# EAGLE design Oled Lochraster (EAGLE 5.10)
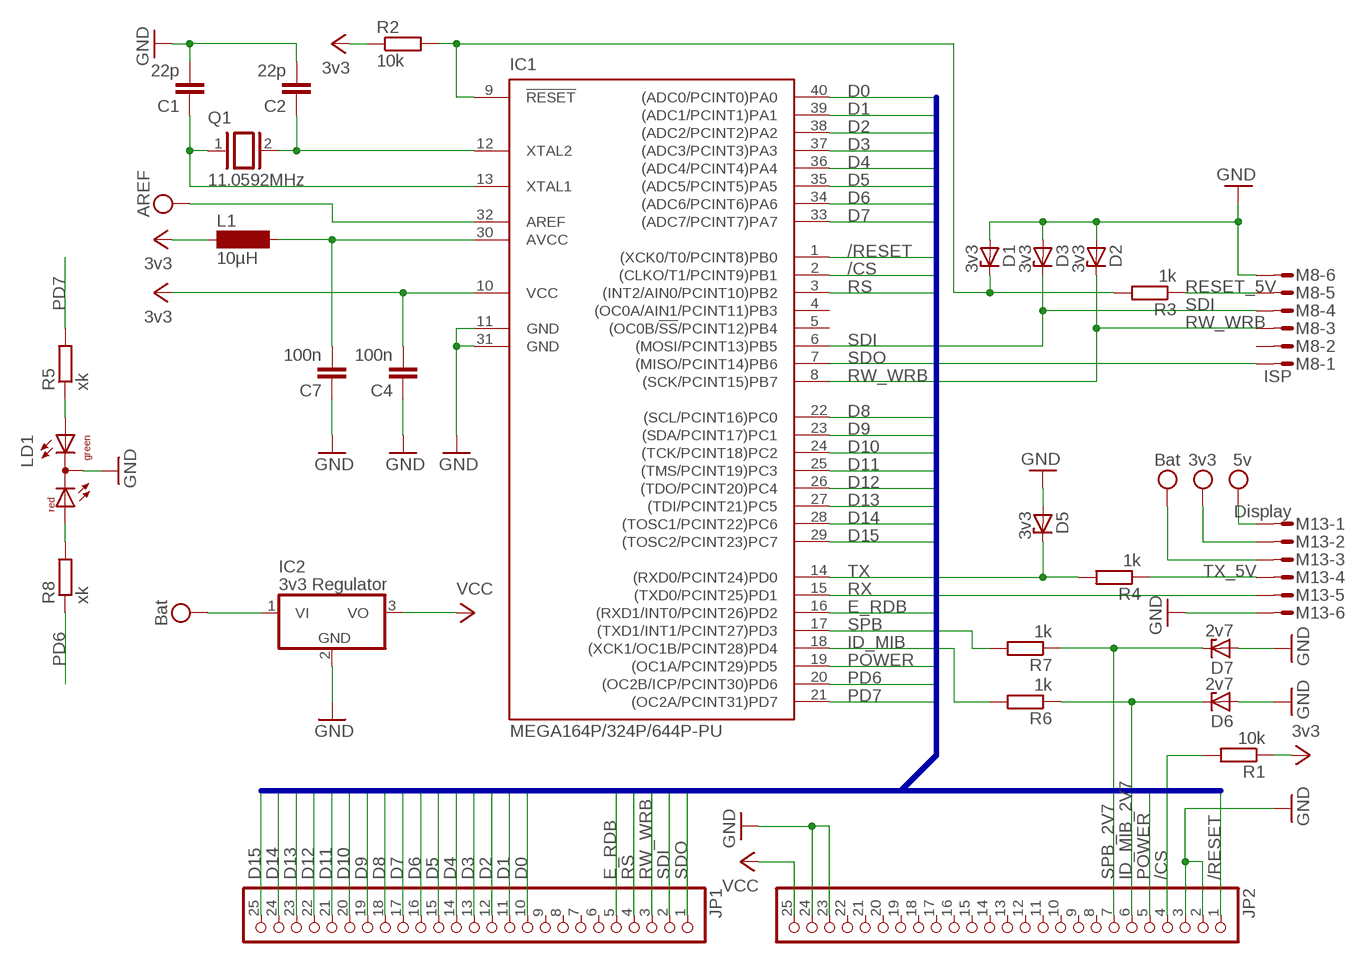
[diagram p0: schematic, sheet 1]

## Parts
C1  22p  C-EUC0805  [C0805]
C2  22p  C-EUC0805  [C0805]
C4  100n  C-EUC0805  [C0805]
C7  100n  C-EUC0805  [C0805]
D1  3v3  ZTE  [DO35Z10]
D2  3v3  ZTE  [DO35Z10]
D3  3v3  ZTE  [DO35Z10]
D5  3v3  ZTE  [DO35Z10]
D6  2v7  ZTE  [DO35Z10]
D7  2v7  ZTE  [DO35Z10]
IC1  MEGA164P/324P/644P-PU  [DIL40]
IC2  3v3 Regulator  7805T  [TO220H]
JP1  PINHD-1X25  [1X25]
JP2  PINHD-1X25  [1X25]
L1  10µH  SM-1206  [SM-1206]
LD1  DUOLED-RG-C  [DUOLED-C-5MM]
M8  ISP  MICROMATCH-6  [MICROMATCH-6]
M13  Display  MICROMATCH-6  [MICROMATCH-6]
Q1  11.0592MHz  XTAL/S  [QS]
R1  10k  R-EU_R0805  [R0805]
R2  10k  R-EU_R0805  [R0805]
R3  1k  R-EU_R0805  [R0805]
R4  1k  R-EU_R0805  [R0805]
R5  xk  R-EU_R0805  [R0805]
R6  1k  R-EU_R0805  [R0805]
R7  1k  R-EU_R0805  [R0805]
R8  xk  R-EU_R0805  [R0805]

## Nets
3V3: C4.2 IC1.10(VCC) L1.1 M13.2 R1.1 R2.1 ; supply symbol labelled 3v3
5V: M13.1 ; supply symbol labelled 5v
/CS: IC1.2((CLKO/T1/PCINT9)PB1) JP2.4 R1.2
/RESET: IC1.1((XCK0/T0/PCINT8)PB0) JP2.1
AREF: IC1.32(AREF)
AVCC: C7.2 IC1.30(AVCC) L1.2
BAT: IC2.1(VI) M13.3 ; supply symbol labelled Bat
D0: IC1.40((ADC0/PCINT0)PA0) JP1.10
D1: IC1.39((ADC1/PCINT1)PA1) JP1.11
D2: IC1.38((ADC2/PCINT2)PA2) JP1.12
D3: IC1.37((ADC3/PCINT3)PA3) JP1.13
D4: IC1.36((ADC4/PCINT4)PA4) JP1.14
D5: IC1.35((ADC5/PCINT5)PA5) JP1.15
D6: IC1.34((ADC6/PCINT6)PA6) JP1.16
D7: IC1.33((ADC7/PCINT7)PA7) JP1.17
D8: IC1.22((SCL/PCINT16)PC0) JP1.18
D9: IC1.23((SDA/PCINT17)PC1) JP1.19
D10: IC1.24((TCK/PCINT18)PC2) JP1.20
D11: IC1.25((TMS/PCINT19)PC3) JP1.21
D12: IC1.26((TDO/PCINT20)PC4) JP1.22
D13: IC1.27((TDI/PCINT21)PC5) JP1.23
D14: IC1.28((TOSC1/PCINT22)PC6) JP1.24
D15: IC1.29((TOSC2/PCINT23)PC7) JP1.25
E_RDB: IC1.16((RXD1/INT0/PCINT26)PD2) JP1.5
GND: C1.2 C2.2 C4.1 C7.1 D1.A D2.A D3.A D5.A D6.A D7.A IC1.11(GND) IC1.31(GND) IC2.2(GND) JP2.2 JP2.3 JP2.23 JP2.24 LD1.C M8.6 M13.6
ID_MIB: IC1.18((XCK1/OC1B/PCINT28)PD4) R6.2
ID_MIB_2V7: D6.C JP2.6 R6.1
N$1: LD1.AR R8.2
N$2: LD1.AX(AG) R5.1
PD6: IC1.20((OC2B/ICP/PCINT30)PD6) R8.1
PD7: IC1.21((OC2A/PCINT31)PD7) R5.2
POWER: IC1.19((OC1A/PCINT29)PD5) JP2.5
RESET: D1.C R2.2 R3.2
RESET_5V: M8.5 R3.1
RS: IC1.3((INT2/AIN0/PCINT10)PB2) JP1.4
RW_WRB: D2.C IC1.8((SCK/PCINT15)PB7) JP1.3 M8.3
RX: IC1.15((TXD0/PCINT25)PD1) M13.5
SDI: D3.C IC1.6((MOSI/PCINT13)PB5) JP1.2 M8.4
SDO: IC1.7((MISO/PCINT14)PB6) JP1.1 M8.1
SPB: IC1.17((TXD1/INT1/PCINT27)PD3) R7.2
SPB_2V7: D7.C JP2.7 R7.1
TX: D5.C IC1.14((RXD0/PCINT24)PD0) R4.2
TX_5V: M13.4 R4.1
VCC: IC2.3(VO) JP2.25
XTAL1: C1.1 IC1.13(XTAL1) Q1.1
XTAL2: C2.1 IC1.12(XTAL2) Q1.2
Unconnected: IC1.4((OC0A/AIN1/PCINT11)PB3) IC1.5((OC0B/!SS!/PCINT12)PB4) IC1.9(!RESET) JP1.6 JP1.7 JP1.8 JP1.9 JP2.8 JP2.9 JP2.10 JP2.11 JP2.12 JP2.13 JP2.14 JP2.15 JP2.16 JP2.17 JP2.18 JP2.19 JP2.20 JP2.21 JP2.22 M8.2

## Buses
B$1

## Library data of the parts
C1 C2 C4 C7 = rcl:C-EU: CAPACITOR, European symbol
D1-D3 D5-D7 = diode:ZTE: Z DIODE 300 mW
IC1 = avr-6:MEGA164P/324P/644P-PU
IC2 = pst-dimension-engineering:78*: Positive VOLTAGE REGULATOR Source: http://cache.national.com/ds/LM/LM78L05.pdf http://www.fairchildsemi.com/ds/LM/LM7805.pdf
JP1 JP2 = pinhead:PINHD-1X25: PIN HEADER
L1 = inductor-neosid:SM-1206: INDUCTOR SMD chip inductor
LD1 = led:DUOLED-RG-C: DUO LED 2 colors (red/green), 5 mm, round, common Cathode www.ligitek.com or other producers.
M8 M13 = con-amp-micromatch:MICROMATCH-6: MicroMaTch 6 7-215464-6 / 0-215464-6 Drawing Number C-215464 DDEController.pdf
Q1 = special:XTAL/S: CRYSTAL
R1-R8 = rcl:R-EU_: RESISTOR, European symbol

## Board
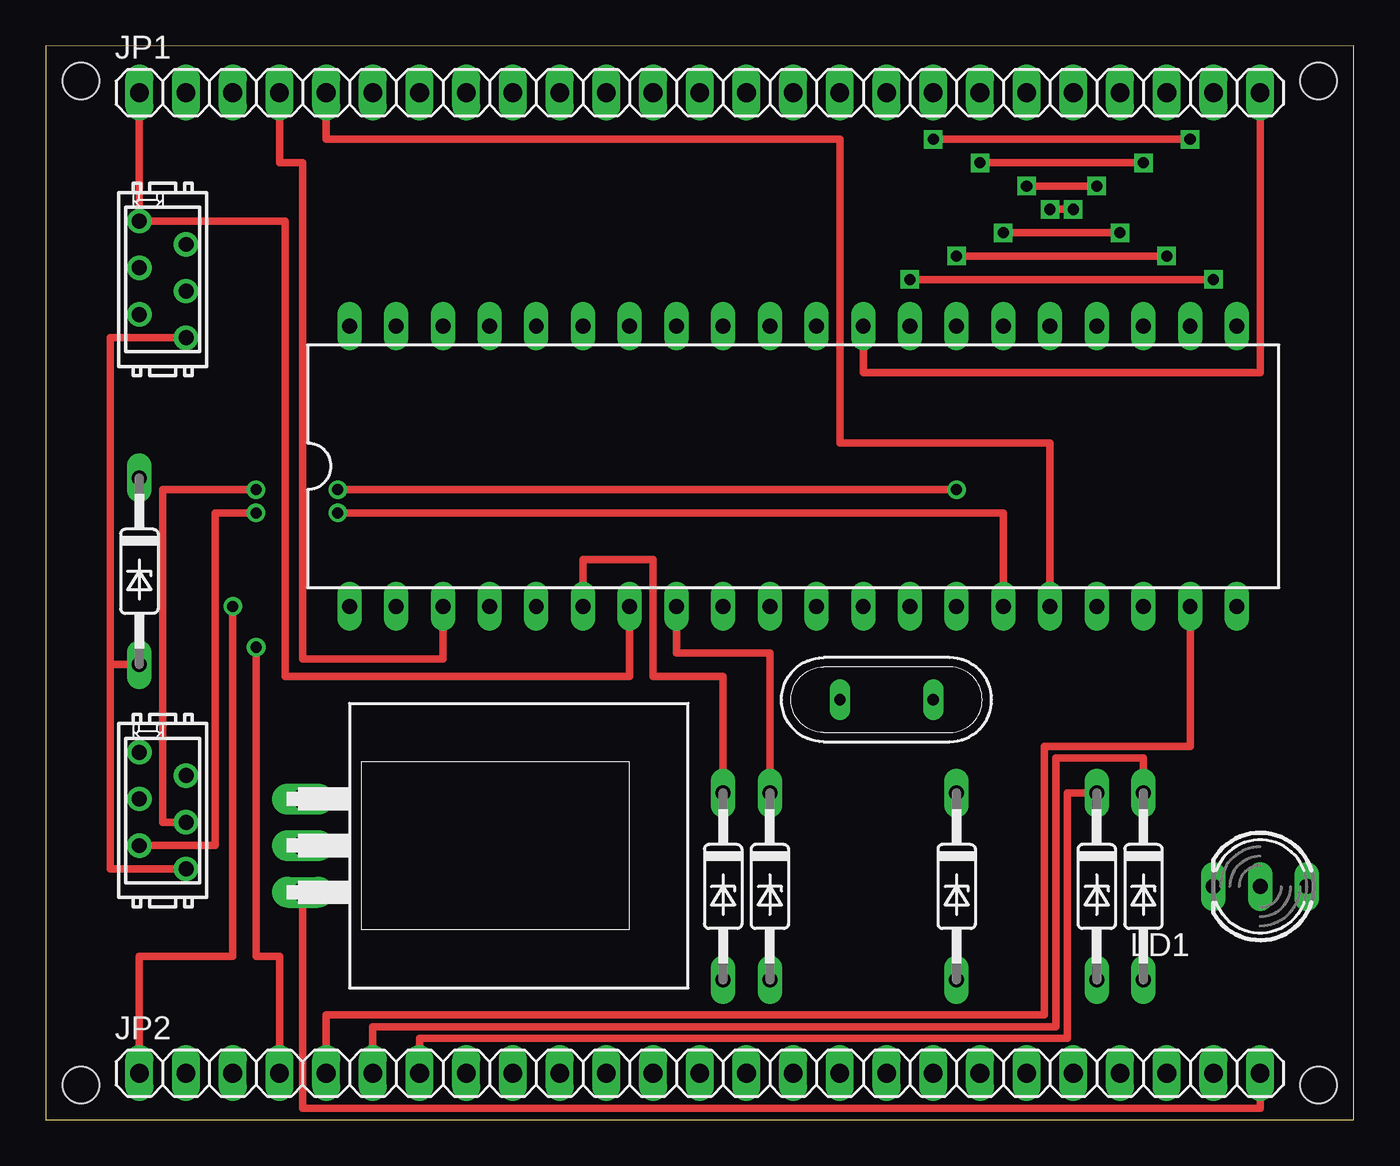
[diagram p1: board, top side]
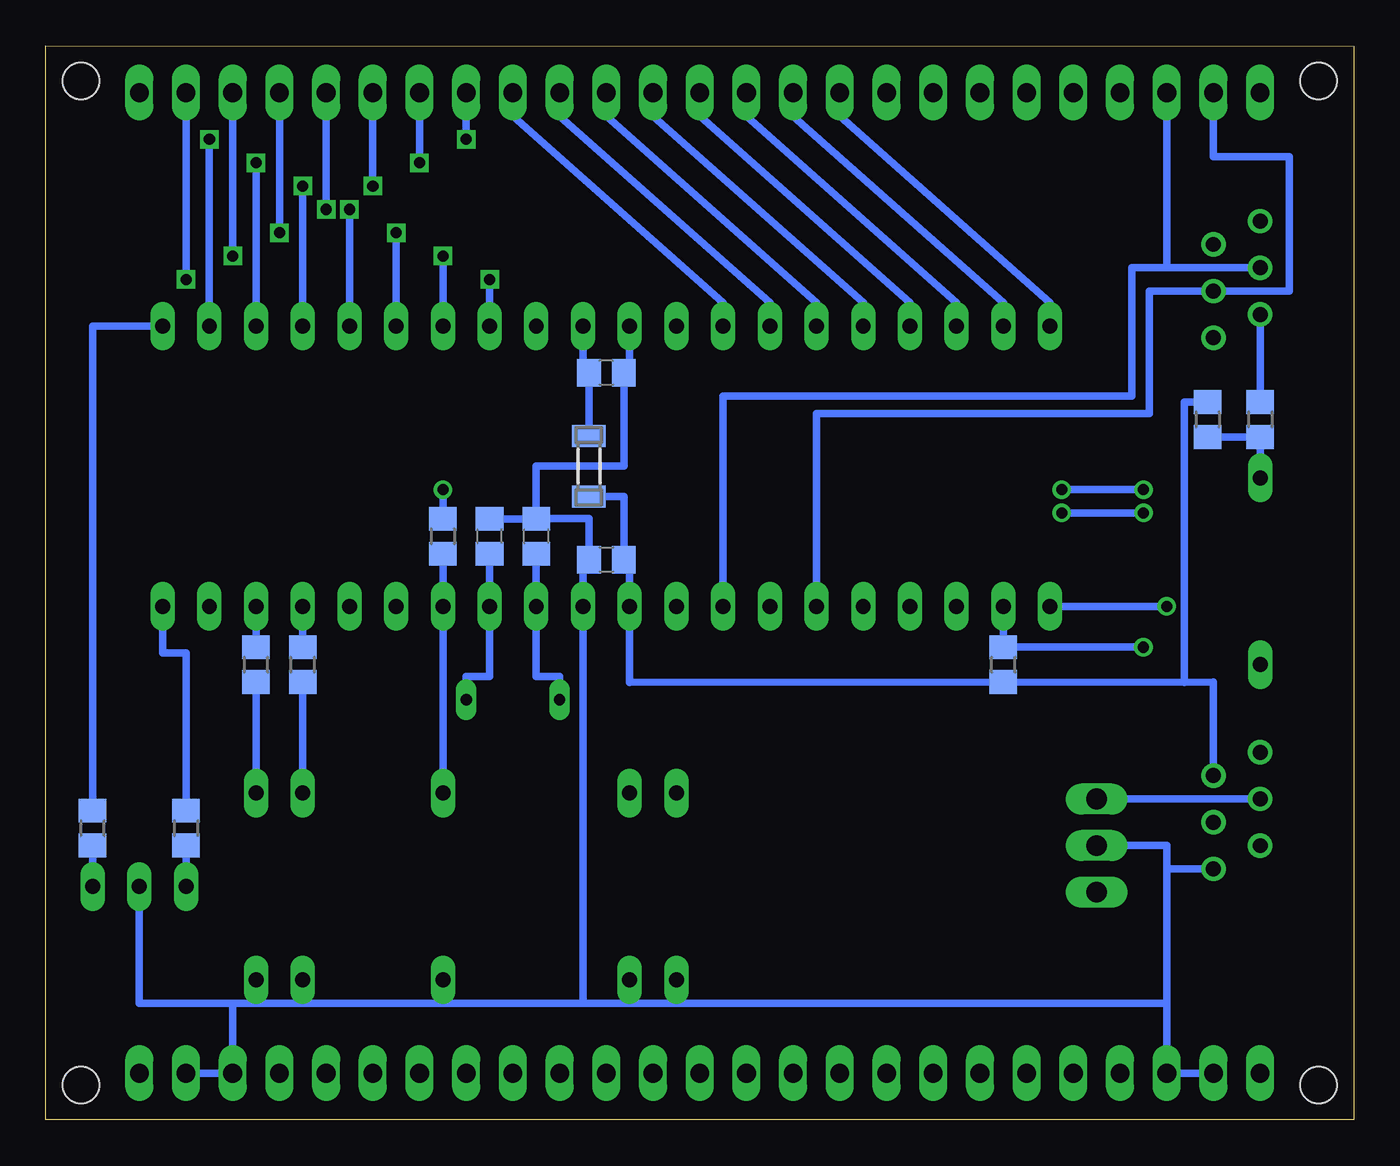
[diagram p2: board, bottom side, seen from below]

Size 71.12 x 58.42 mm. Coordinates in mm from the lower left corner, seen from the top.
Outline: 0,0 71.12,0 71.12,58.42 0,58.41 0,0
Copper layers (1*16): Top 0.035mm / dielectric 1.5mm / Bottom 0.035mm
Design rules "default": minimum track width 10mil, minimum drill 24mil, track to track 8mil, track to pad 8mil, pad to pad 8mil, via to via 8mil, smd to smd 8mil, copper to edge 40mil, drill to drill 8mil, minimum pad ring 10mil, minimum via ring 8mil, stop-mask expansion 4mil, vias tented up to drill 0mil, thermal gap 10mil
Holes 2 mm at 1.9,56.52 1.9,1.9 69.22,1.9 69.22,56.52

### Footprints (pad centres in the part's own frame; a part is rotated, then mirrored left to right if it is on the bottom)
C0805 = smd 1.3 x 1.5: 1 -0.95,0; 2 0.95,0
DO35Z10 = drill 0.813 long: A 5.08,0; C -5.08,0
DIL40 = drill 0.813 long: 1 -24.13,-7.62; 2 -21.59,-7.62; 3 -19.05,-7.62; 4 -16.51,-7.62; 5 -13.97,-7.62; 6 -11.43,-7.62; 7 -8.89,-7.62; 8 -6.35,-7.62; 9 -3.81,-7.62; 10 -1.27,-7.62; 11 1.27,-7.62; 12 3.81,-7.62; 13 6.35,-7.62; 14 8.89,-7.62; 15 11.43,-7.62; 16 13.97,-7.62; 17 16.51,-7.62; 18 19.05,-7.62; 19 21.59,-7.62; 20 24.13,-7.62; 21 24.13,7.62; 22 21.59,7.62; 23 19.05,7.62; 24 16.51,7.62; 25 13.97,7.62; 26 11.43,7.62; 27 8.89,7.62; 28 6.35,7.62; 29 3.81,7.62; 30 1.27,7.62; 31 -1.27,7.62; 32 -3.81,7.62; 33 -6.35,7.62; 34 -8.89,7.62; 35 -11.43,7.62; 36 -13.97,7.62; 37 -16.51,7.62; 38 -19.05,7.62; 39 -21.59,7.62; 40 -24.13,7.62
TO220H = drill 1.118 long: 1 -2.54,-10.16; 2 0,-10.16; 3 2.54,-10.16
1X25 = drill 1.016 long: 1 -29.21,0; 2 -26.67,0; 3 -24.13,0; 4 -21.59,0; 5 -19.05,0; 6 -16.51,0; 7 -13.97,0; 8 -11.43,0; 9 -8.89,0; 10 -6.35,0; 11 -3.81,0; 12 -1.27,0; 13 1.27,0; 14 3.81,0; 15 6.35,0; 16 8.89,0; 17 11.43,0; 18 13.97,0; 19 16.51,0; 20 19.05,0; 21 21.59,0; 22 24.13,0; 23 26.67,0; 24 29.21,0; 25 31.75,0
SM-1206 = smd 1.2 x 1.8: 1 -1.65,0; 2 1.65,0
DUOLED-C-5MM = drill 0.813 long: AR 2.54,0; AX -2.54,0; C 0,0
MICROMATCH-6 = drill 0.813 round: 1 3.175,1.27; 2 1.905,-1.27; 3 0.635,1.27; 4 -0.635,-1.27; 5 -1.905,1.27; 6 -3.175,-1.27
QS = drill 0.61 long: 1 -2.54,0; 2 2.54,0
R0805 = smd 1.3 x 1.5: 1 -0.95,0; 2 0.95,0

### Placement (x,y rotation side)
C1  46.99,31.75 90 bottom
C2  44.45,31.75 90 bottom
C4  40.64,30.48 0 bottom
C7  40.64,40.64 180 bottom
D1  5.08,29.84 270 top
D2  39.37,12.7 270 top
D3  36.83,12.7 270 top
D5  49.53,12.7 270 top
D6  59.69,12.7 270 top
D7  57.15,12.7 270 top
IC1  40.64,35.56 0 top
IC2  24.13,14.92 270 top
JP1  34.29,55.88 0 top
JP2  34.29,2.54 0 top
L1  41.59,35.56 90 bottom
LD1  66.04,12.7 180 top
M8  6.35,45.72 90 top
M13  6.35,16.83 90 top
Q1  45.72,22.86 180 top
R1  19.05,24.77 90 bottom
R2  7.94,38.1 270 bottom
R3  5.08,38.1 270 bottom
R4  49.53,31.75 270 bottom
R5  68.58,15.88 90 bottom
R6  59.69,24.77 90 bottom
R7  57.15,24.77 90 bottom
R8  63.5,15.88 270 bottom

### Tracks (layer width: path | path; a pad name or v marks a point on that pad's centre or on a via)
3V3
  Bottom 0.406: 9.21,23.81 9.21,39.05 R2.1 | 9.21,23.81 R1.1 39.37,23.81 IC1.10 39.37,30.16 C4.2 39.69,33.91 L1.1 | M13.2 7.62,23.81 9.21,23.81
/CS  (via drill 0.6)
  Top 0.406: v11.43,25.71 11.43,24.83 11.43,19.37 11.43,8.89 12.7,8.89 JP2.4
  Bottom 0.406: IC1.2 R1.2 v11.43,25.71
/RESET  (via drill 0.6)
  Top 0.406: JP2.1 5.08,8.89 10.16,8.89 v10.16,27.94
  Bottom 0.406: v10.16,27.94 IC1.1
AVCC
  Bottom 0.406: IC1.30 41.91,40.96 C7.2 L1.2
BAT
  Bottom 0.406: M13.3 IC2.1
D0
  Bottom 0.406: JP1.10 27.94,54.61 16.51,44.45 IC1.40
D1
  Bottom 0.406: JP1.11 30.48,54.61 19.05,44.45 IC1.39
D2
  Bottom 0.406: JP1.12 33.02,54.61 21.59,44.45 IC1.38
D3
  Bottom 0.406: JP1.13 35.56,54.61 24.13,44.45 IC1.37
D4
  Bottom 0.406: JP1.14 38.1,54.61 26.67,44.45 IC1.36
D5
  Bottom 0.406: JP1.15 40.64,54.61 29.21,44.45 IC1.35
D6
  Bottom 0.406: IC1.34 31.75,44.45 43.18,54.61 JP1.16
D7
  Bottom 0.406: IC1.33 34.29,44.45 45.72,54.61 JP1.17
D8  (via drill 0.6)
  Top 0.406: v48.26,53.34 v62.23,53.34
  Bottom 0.406: v62.23,53.34 IC1.22 | v48.26,53.34 JP1.18
D9  (via drill 0.6)
  Top 0.406: v50.8,52.07 v59.69,52.07
  Bottom 0.406: v59.69,52.07 IC1.23 | v50.8,52.07 JP1.19
D10  (via drill 0.6)
  Top 0.406: v57.15,50.8 v53.34,50.8
  Bottom 0.406: IC1.24 v57.15,50.8 | v53.34,50.8 JP1.20
D11  (via drill 0.6)
  Top 0.406: v54.61,49.53 v55.88,49.53
  Bottom 0.406: IC1.25 v54.61,49.53 | v55.88,49.53 JP1.21
D12  (via drill 0.6)
  Top 0.406: v52.07,48.26 v58.42,48.26
  Bottom 0.406: IC1.26 v52.07,48.26 | v58.42,48.26 JP1.22
D13  (via drill 0.6)
  Top 0.406: v49.53,46.99 v60.96,46.99
  Bottom 0.406: IC1.27 v49.53,46.99 | v60.96,46.99 JP1.23
D14  (via drill 0.6)
  Top 0.406: v46.99,45.72 v63.5,45.72
  Bottom 0.406: IC1.28 v46.99,45.72 | v63.5,45.72 JP1.24
D15
  Top 0.406: IC1.29 44.45,40.64 66.04,40.64 JP1.25
E_RDB
  Top 0.406: IC1.16 54.61,36.83 43.18,36.83 43.18,53.34 15.24,53.34 JP1.5
GND
  Top 0.406: 3.49,24.77 3.49,42.55 M8.6 | 3.49,24.77 D1.A | 3.49,24.77 3.49,13.65 M13.6
  Bottom 0.406: JP2.24 JP2.23 60.96,6.35 | 41.91,6.35 49.53,6.35 | 49.53,6.35 57.15,6.35 | 59.69,6.35 60.96,6.35 | 49.53,6.35 D5.A | 57.15,6.35 D7.A | 57.15,6.35 59.69,6.35 | 59.69,6.35 D6.A | 36.83,6.35 D3.A | 10.16,6.35 36.83,6.35 | 36.83,6.35 39.37,6.35 | JP2.2 JP2.3 10.16,6.35 | IC1.31 39.37,40.64 C7.1 39.69,35.56 44.45,35.56 C2.2 | C2.2 C1.2 | C2.2 41.59,32.7 C4.1 41.91,30.16 IC1.11 41.91,6.35 | 39.37,6.35 D2.A | 39.37,6.35 41.91,6.35 | 10.16,13.65 M13.6 | 10.16,13.65 10.16,14.92 IC2.2 | 10.16,6.35 10.16,13.65 | LD1.C 66.04,6.35 60.96,6.35
ID_MIB
  Bottom 0.406: R6.2 IC1.18
ID_MIB_2V7
  Top 0.406: JP2.6 17.78,5.08 54.93,5.08 54.93,19.69 59.69,19.69 D6.C
  Bottom 0.406: D6.C R6.1
N$1
  Bottom 0.406: LD1.AR R8.2
N$2
  Bottom 0.406: R5.1 LD1.AX
PD6
  Bottom 0.406: R8.1 63.5,25.4 64.77,25.4 IC1.20
PD7
  Bottom 0.406: IC1.21 68.58,43.18 R5.2
POWER
  Top 0.406: JP2.5 15.24,5.71 54.29,5.71 54.29,20.32 62.23,20.32 IC1.19
RESET
  Bottom 0.406: R2.2 R3.2 D1.C
RESET_5V
  Bottom 0.406: R3.1 M8.5
RS
  Top 0.406: IC1.3 21.59,25.08 13.97,25.08 13.97,52.07 12.7,52.07 JP1.4
RW_WRB
  Top 0.406: D2.C 39.37,25.4 34.29,25.4 IC1.8
  Bottom 0.406: M8.3 10.16,46.36 | 10.16,46.36 JP1.3 | IC1.8 34.29,39.37 12.06,39.37 12.06,46.36 10.16,46.36
RX  (via drill 0.6)
  Top 0.406: M13.5 9.21,14.92 9.21,33.02 v11.43,33.02 | v15.87,33.02 52.07,33.02 IC1.15
  Bottom 0.406: v11.43,33.02 v15.87,33.02
SDI
  Top 0.406: D3.C 36.83,24.13 33.02,24.13 33.02,30.48 29.21,30.48 IC1.6
  Bottom 0.406: JP1.2 7.62,52.39 3.49,52.39 3.49,45.09 M8.4 11.11,45.09 11.11,38.42 29.21,38.42 IC1.6
SDO
  Top 0.406: JP1.1 M8.1 13.02,48.89 13.02,24.13 31.75,24.13 IC1.7
SPB
  Bottom 0.406: R7.2 IC1.17
SPB_2V7
  Top 0.406: JP2.7 20.32,4.45 55.56,4.45 55.56,17.78 D7.C
  Bottom 0.406: D7.C R7.1
TX
  Bottom 0.406: R4.2 IC1.14 D5.C
TX_5V  (via drill 0.6)
  Top 0.406: M13.4 6.35,16.19 6.35,34.29 v11.43,34.29 | v15.87,34.29 v49.53,34.29
  Bottom 0.406: v49.53,34.29 R4.1 | v11.43,34.29 v15.87,34.29
VCC
  Top 0.406: JP2.25 66.04,0.63 13.97,0.63 IC2.3
XTAL1
  Bottom 0.406: C1.1 IC1.13 46.99,24.13 48.26,24.13 Q1.1
XTAL2
  Bottom 0.406: C2.1 IC1.12 44.45,24.13 43.18,24.13 Q1.2